# EAGLE design HD (EAGLE 9.5.2)
AUTHOR: Xueshi; COMPANY: DTU; DATE: 2017-12-20; INFOSETTINGS: Used by 'plot.ulp' - do not edit manually! |FileTime=2017-04-26, 16:03:01|FileVersion=2||[LabelBox]|Company=DTU|Title=BroadbandHD|Description=|Revision=2015-01-21|Date=2015-01-21|Author=T. Gehring|RevisionDate1=|RevisionAuthor1=|RevisionDate2=|RevisionAuthor2=|RevisionDate3=|RevisionAuthor3=|RevisionDate4=|RevisionAuthor4=|RevisionDate5=|RevisionAuthor5=||[FrontMatter]|DocTitle=Homodyne Detector @1550nm for Tomography|SubTitle=Circuit Board Documentation|Authors=Xueshi Guo|Keywords=|Abstract=Broadband homodyne detector with DC and highpass filtered AC output.\nModified based on the design of G. Tobias.|LaTeXSyntax=0||[Safety]|VoltageHazard=0|HeatHazard=0|Convection=0|ForcedAir=0|WaterCooling=0|LightHazard=0|LaserPower=1000|LaserWavelength=1064|LaserClass=6|LightPower=1000|LightInvisible=0||[Notes]|Machinery=0|IntendedUsers=0|DisplayHints=1|; PLOTSETTINGS: Used by 'plot.ulp' - do not edit manually! |FileTime=2017-04-26, 16:03:01|FileVersion=2||[Board]|CreateBoard=1|PadDisplay=1|CreateDrillPlan=1|SiebMeyerFormat=0|IsiDrillFormat=1|CreateSolderStop=1|CreateCreamMask=0|CreateLegend=0|DisplayDimension=0|DisplayReference=1|CompensateSkew=0||[Documentation]|CreateDocumentation=1|CreateSheetDocs=1|DisplayNames=1|DisplayValues=1|DisplaySimulate=0|CreatePartList=1|CreateBoardDocs=1|CreatePlaceplan=1|DisplayJumper=0|CreateWiring=1|DisplayVias=1|CreateDrillMap=0|Create800uMap=0|CreatePreview=0|CreateValueList=1|CreateNetList=0|CreateLaTeX=1||[Variants]|HighlightUndefines=1|HighlightVariants=1|ShowVariantLists=1||[BoardSetup]|ProcessPolygons=0|PageSize=0|PageOrientation=0|MarginLeft=5|MarginTop=5|MarginRight=5|MarginBottom=5|DrillRackMM=0||[DocumentationSetup]|BlackWhite=0|FigureWidth=168|FigureHeight=237|ShrinkFigure=1|ExpandFigure=0|FigureRotate=1|TextWidth=72|ValueLibrary=1|PalatinoFont=1|LuximonoFont=0|IgnoreWidth=1||[MiscSetup]|OutlinePrecision=0.5|OutlineDiameter=2|; REVISION: 2017-12-20; TITLE: HD@1550nm

## Sheet 1 of 3
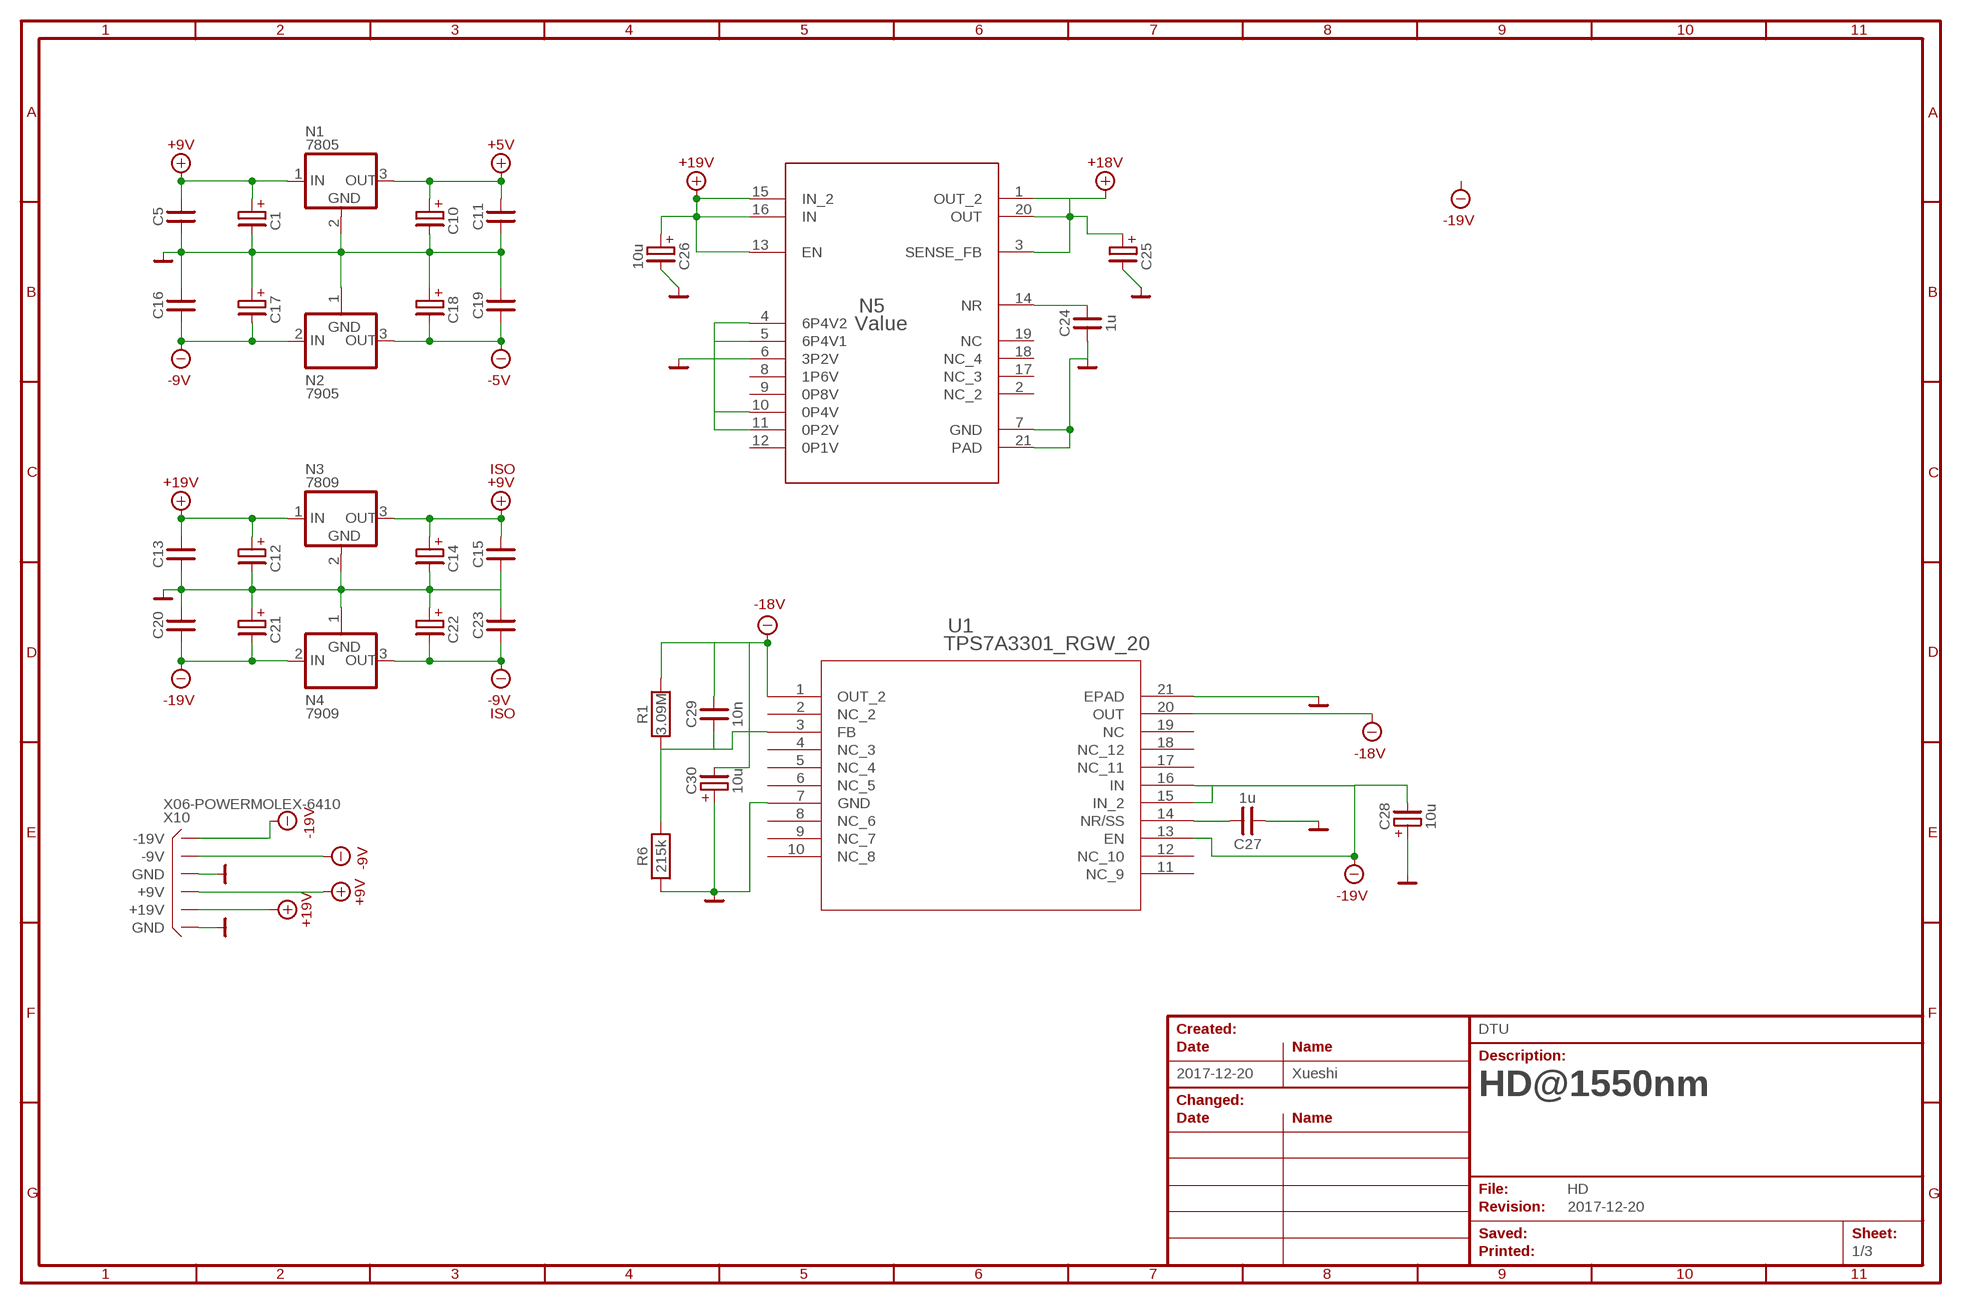
[diagram p0: schematic, sheet 1]
$1 (FRAME-A4-LANDSCAPE): SPICE: <ignore>

### Parts
C1  CEC  [CEC]
C5  C0805  [C0805]
C10  CEC  [CEC]
C11  C0805  [C0805]
C12  CEC  [CEC]
C13  C0805  [C0805]
C14  CEC  [CEC]
C15  C0805  [C0805]
C16  C0805  [C0805]
C17  CEC  [CEC]
C18  CEC  [CEC]
C19  C0805  [C0805]
C20  C0805  [C0805]
C21  CEC  [CEC]
C22  CEC  [CEC]
C23  C0805  [C0805]
C24  1u  C0805  [C0805]
C25  CEC  [CEC]
C26  10u  CEC  [CEC]
C27  1u  C0805  [C0805]
C28  10u  CEC  [CEC]
C29  10n  C0805  [C0805]
C30  10u  CEC  [CEC]
N1  7805  7805S2  [TO252]
N2  7905  7905S2  [TO252]
N3  7809  7809S2  [TO252]
N4  7909  7909S2  [TO252]
N5  Value  TPS7A4701RGWR  [RGW0020A]
R1  3.09M  R0805  [R0805]
R6  215k  R0805  [R0805]
U1  TPS7A3301_RGW_20  [RGW0020A]
X10  X06-POWERMOLEX-6410  [X06-MOLEX-6410]

### Nets
+5V: C10.+ C11.2 N1.3(OUT) ; supply symbol labelled V+5V ; also sheet 2
+9V: C1.+ C5.1 N1.1(IN) X10.P$4(+9V) ; supply symbol labelled V+9V
+9VISO: C14.+ C15.2 N3.3(OUT) ; supply symbol labelled V+9V-ISO ; also sheet 3
+18V: C25.+ N5.1(OUT_2) N5.3(SENSE_FB) N5.20(OUT) ; supply symbol labelled V+18V ; also sheet 2
+19V: C12.+ C13.1 C26.+ N3.1(IN) N5.13(EN) N5.15(IN_2) N5.16(IN) X10.P$5(+19V) ; supply symbol labelled V+19V
-5V: C18.- C19.1 N2.3(OUT) ; supply symbol labelled V-5V ; also sheet 2
-9V: C16.2 C17.- N2.2(IN) X10.P$2(-9V) ; supply symbol labelled V-9V
-9VISO: C22.- C23.1 N4.3(OUT) ; supply symbol labelled V-9V-ISO ; also sheet 3
-18V: C29.2 C30.- R1.2 U1.1(OUT_2) U1.20(OUT) ; supply symbol labelled V-18V ; also sheet 2
-19V: C20.2 C21.- C28.- N4.2(IN) U1.13(EN) U1.15(IN_2) U1.16(IN) X10.P$1(-19V) ; supply symbol labelled V-19V
GND: C1.- C5.2 C10.- C11.1 C12.- C13.2 C14.- C15.1 C16.1 C17.+ C18.+ C19.2 C20.1 C21.+ C22.+ C23.2 C24.1 C25.- C26.- C27.1 C28.+ C30.+ N1.2(GND) N2.1(GND) N3.2(GND) N4.1(GND) N5.4(6P4V2) N5.5(6P4V1) N5.6(3P2V) N5.7(GND) N5.10(0P4V) N5.11(0P2V) N5.21(PAD) R6.1 U1.7(GND) U1.21(EPAD) X10.P$3(GND) X10.P$6(GND) ; supply symbol labelled VG ; also sheet 2,3
N$2: C24.2 N5.14(NR)
N$5: C27.2 U1.14(NR/SS)
N$9: C29.1 R1.1 R6.2 U1.3(FB)
Unconnected: N5.2(NC_2) N5.8(1P6V) N5.9(0P8V) N5.12(0P1V) N5.17(NC_3) N5.18(NC_4) N5.19(NC) U1.2(NC_2) U1.4(NC_3) U1.5(NC_4) U1.6(NC_5) U1.8(NC_6) U1.9(NC_7) U1.10(NC_8) U1.11(NC_9) U1.12(NC_10) U1.17(NC_11) U1.18(NC_12) U1.19(NC)

## Sheet 2 of 3
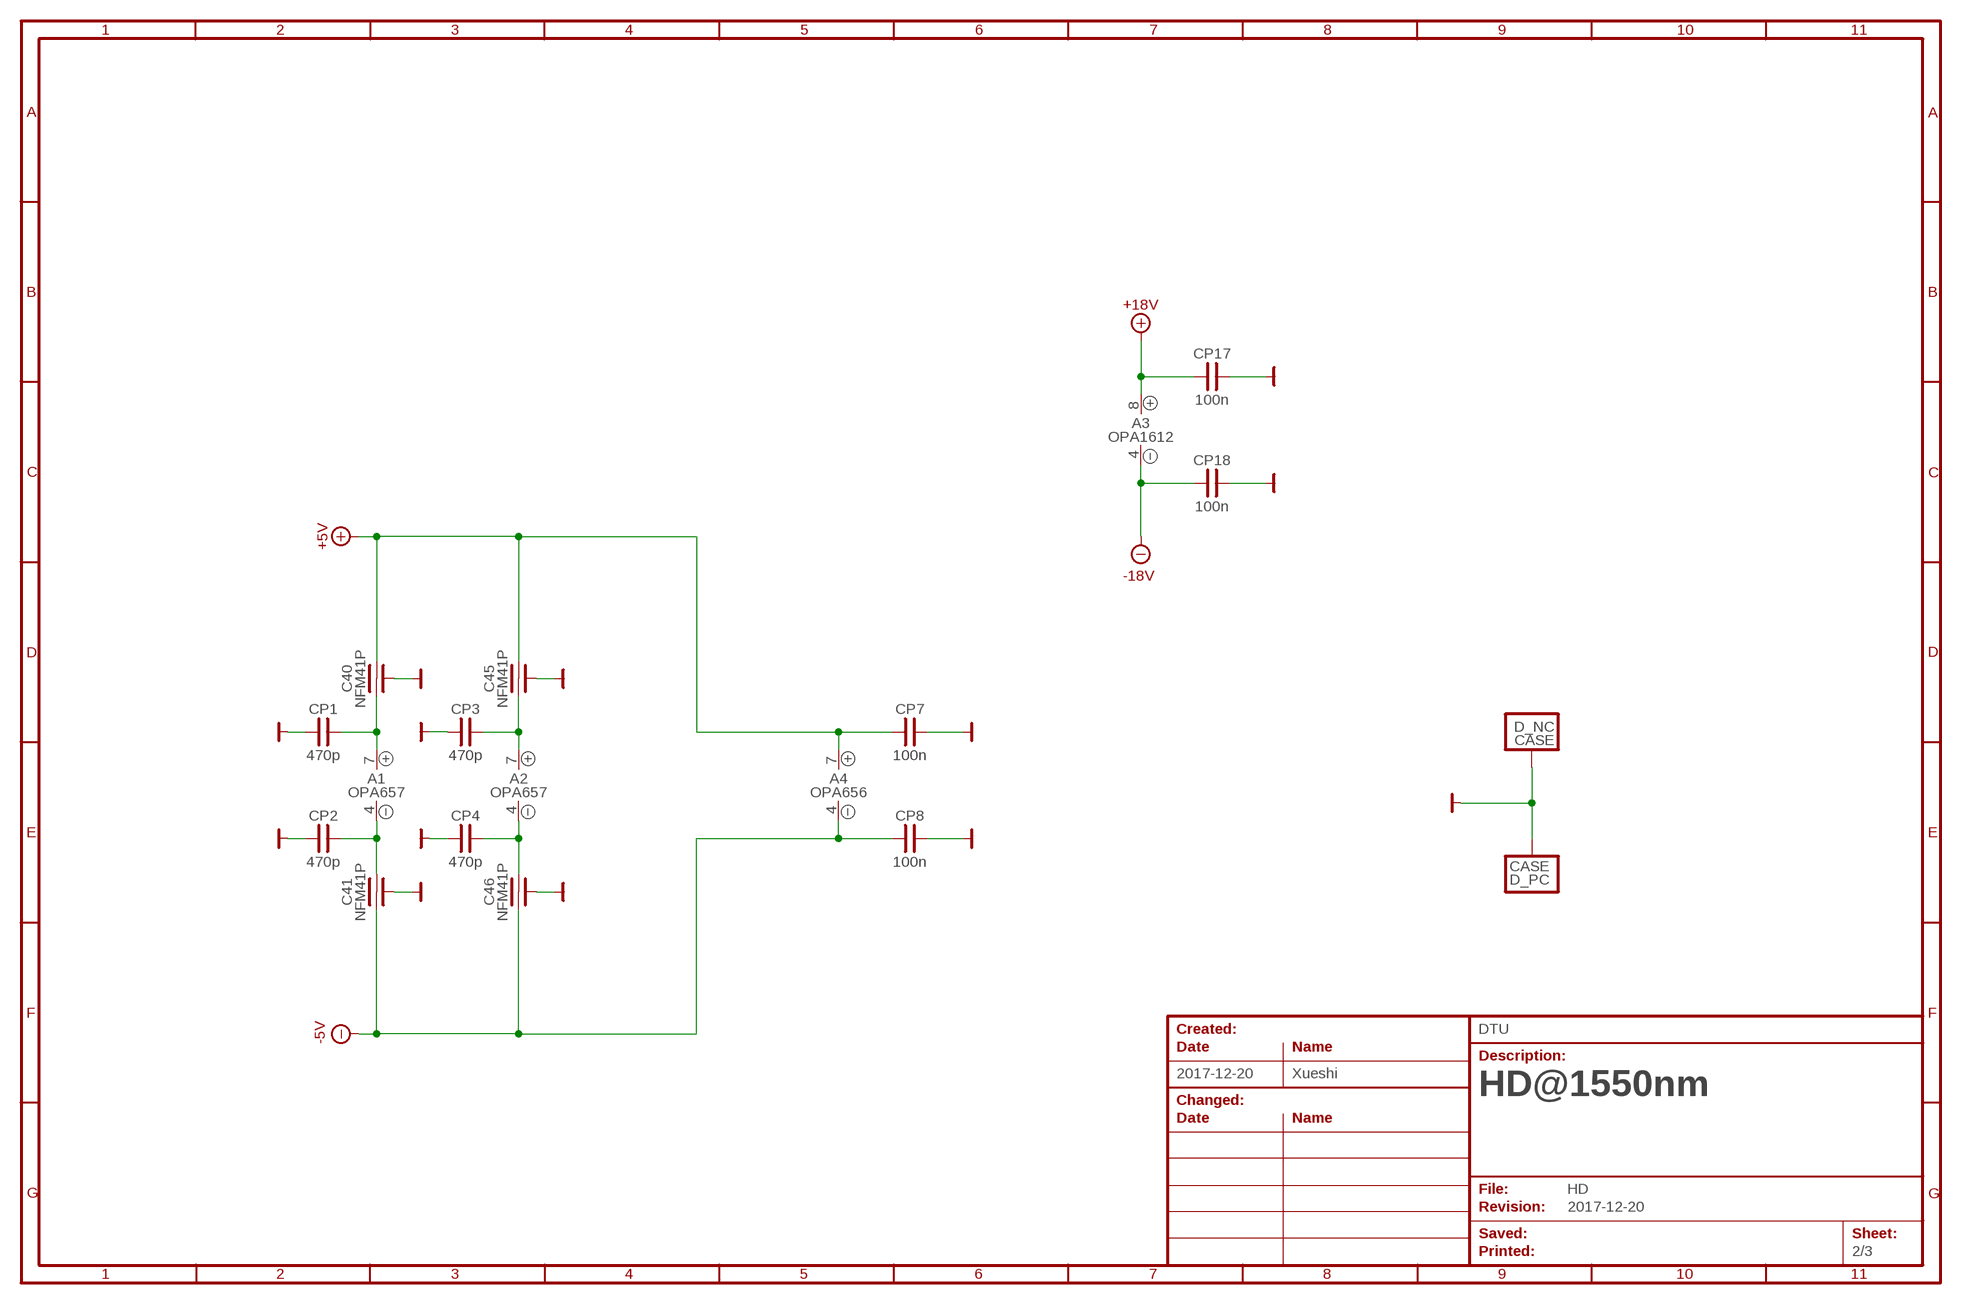
[diagram p1: schematic, sheet 2]
$8 (FRAME-A4-LANDSCAPE): SPICE: <ignore>

### Parts
A1  OPA657  [SO08]
A2  OPA657  [SO08]
A3  OPA1612  OPA2107S  [SO08]
A4  OPA656  OPA657  [SO08]
C40  NFM41P  CF  [CF-NFM41P]
C41  NFM41P  CF  [CF-NFM41P]
C45  NFM41P  CF  [CF-NFM41P]
C46  NFM41P  CF  [CF-NFM41P]
CP1  470p  C0603  [C0603]
CP2  470p  C0603  [C0603]
CP3  470p  C0603  [C0603]
CP4  470p  C0603  [C0603]
CP7  100n  C0603  [C0603]
CP8  100n  C0603  [C0603]
CP17  100n  C0603  [C0603]
CP18  100n  C0603  [C0603]
D_N  0.2pF  DP-CLASER_COMPONENTS_PD  [STO5P]
D_P  0.2pF  DP-CLASER_COMPONENTS_PD  [STO5P]

### Nets
+5V: A4.7(P:V+) C40.2 C45.2 CP7.1 ; supply symbol labelled V+5V ; also sheet 1
+18V: A3.8(P:V+) CP17.1 ; supply symbol labelled V+18V ; also sheet 1
-5V: A4.4(P:V-) C41.1 C46.1 CP8.1 ; supply symbol labelled V-5V ; also sheet 1
-18V: A3.4(P:V-) CP18.1 ; supply symbol labelled V-18V ; also sheet 1
GND: C40.GND C41.GND C45.GND C46.GND CP1.1 CP2.1 CP3.1 CP4.1 CP7.2 CP8.2 CP17.2 CP18.2 D_N.3(CASE) D_P.3(CASE) ; supply symbol labelled VG ; also sheet 1,3
N$41: A1.4(P:V-) C41.2 CP2.2
N$43: A1.7(P:V+) C40.1 CP1.2
N$45: A2.4(P:V-) C46.2 CP4.2
N$46: A2.7(P:V+) C45.1 CP3.2

## Sheet 3 of 3
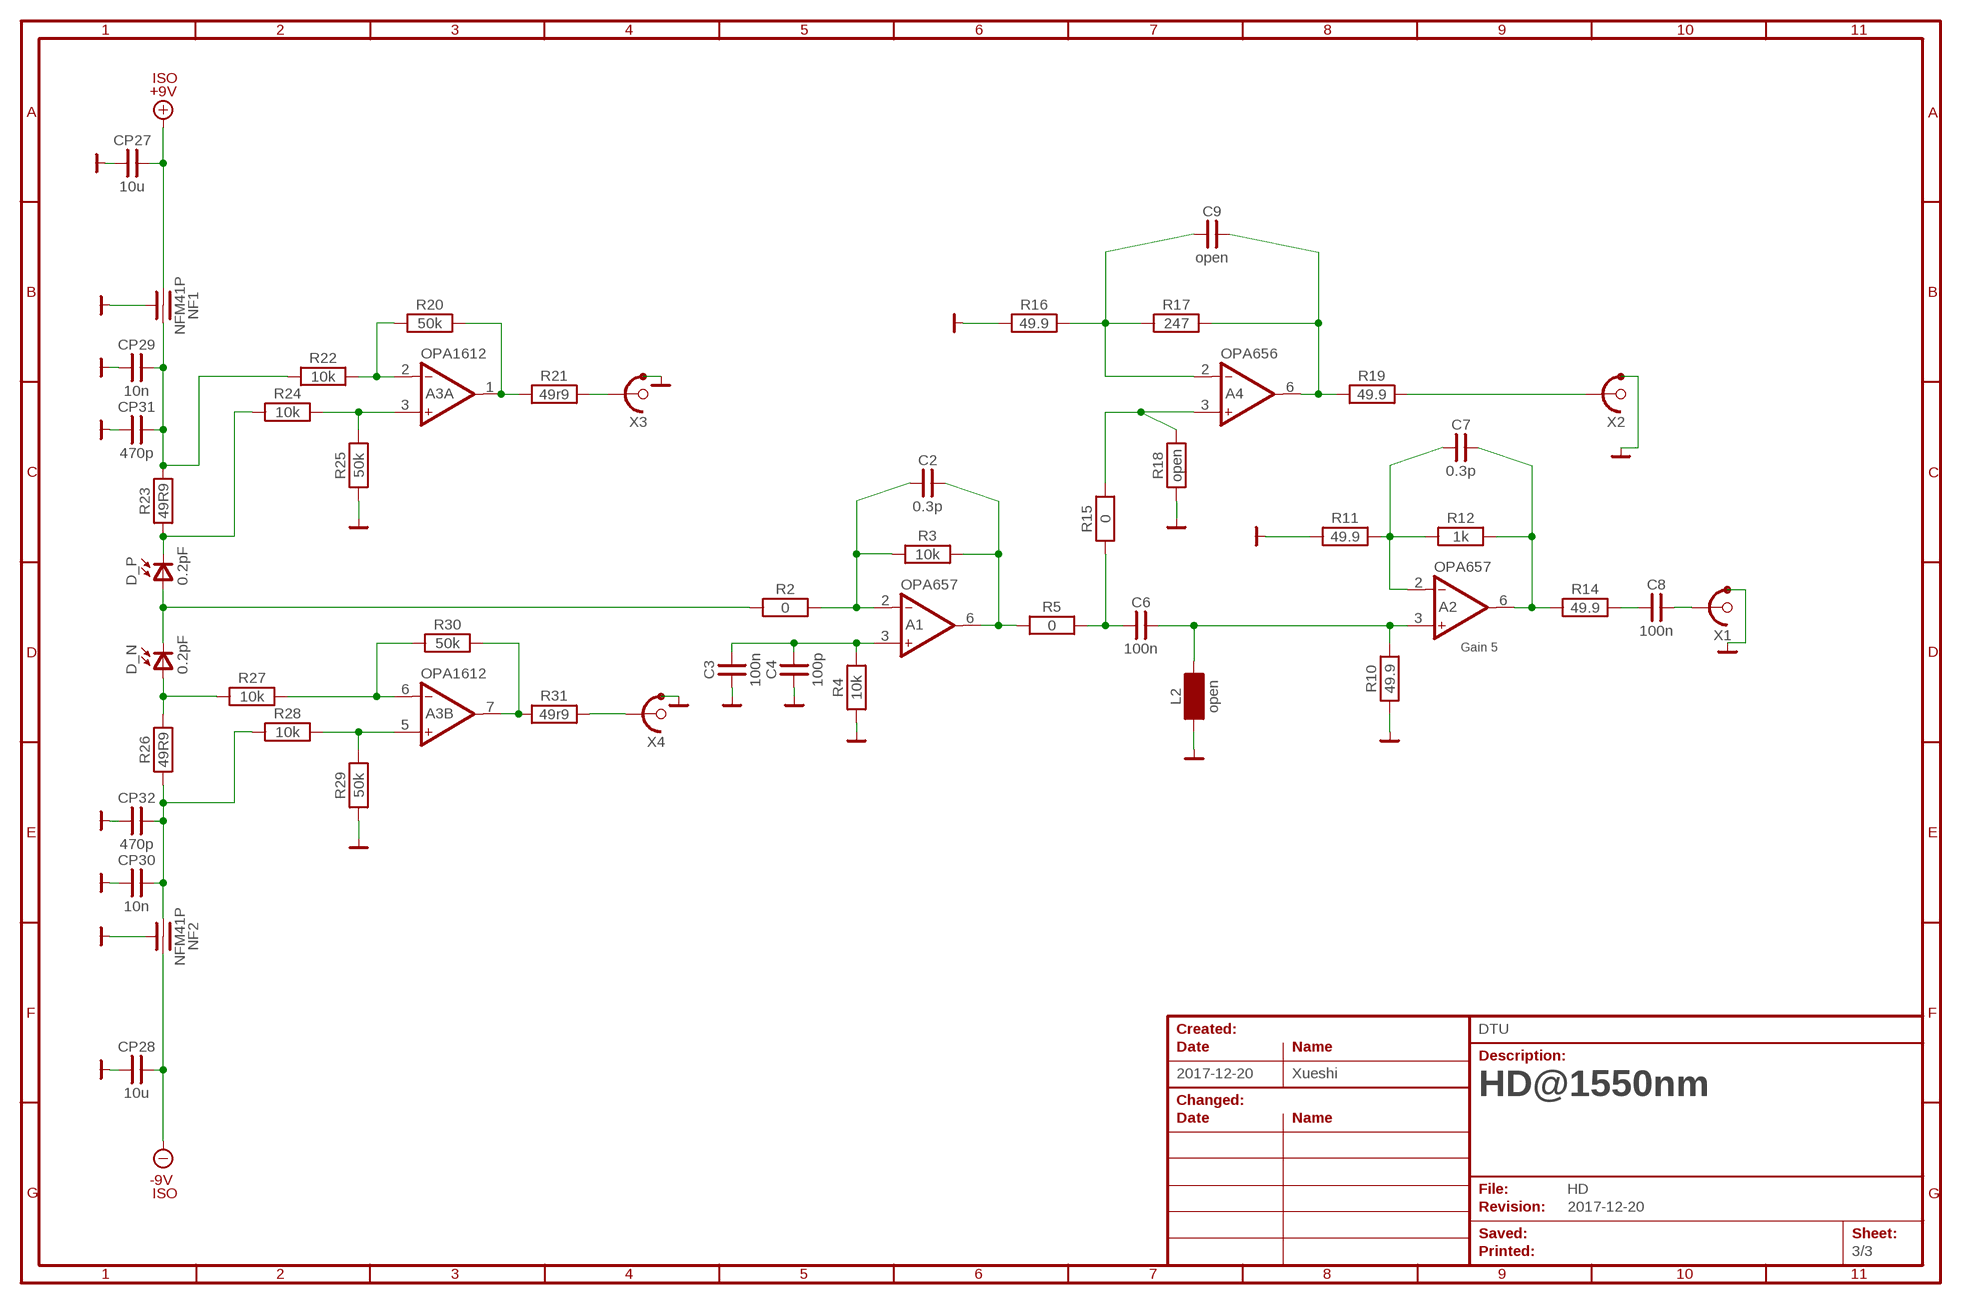
[diagram p2: schematic, sheet 3]
$68 (FRAME-A4-LANDSCAPE): SPICE: <ignore>

### Parts
C2  0.3p  C0603  [C0603]
C3  100n  C0603  [C0603]
C4  100p  C0603  [C0603]
C6  100n  C0603  [C0603]
C7  0.3p  C0603  [C0603]
C8  100n  C0603  [C0603]
C9  open  C0603  [C0603]
CP27  10u  C1206  [C1206]
CP28  10u  C1206  [C1206]
CP29  10n  C0805  [C0805]
CP30  10n  C0805  [C0805]
CP31  470p  C0805  [C0805]
CP32  470p  C0805  [C0805]
L2  open  L0603  [L0603]
NF1  NFM41P  CF  [CF-NFM41P]
NF2  NFM41P  CF  [CF-NFM41P]
R2  0  R0603  [R0603]
R3  10k  R0603  [R0603]
R4  10k  R0603  [R0603]
R5  0  R0603  [R0603]
R10  49.9  R0603  [R0603]
R11  49.9  R0603  [R0603]
R12  1k  R0603  [R0603]
R14  49.9  R0603  [R0603]
R15  0  R0805  [R0805]
R16  49.9  R0603  [R0603]
R17  247  R0603  [R0603]
R18  open  R0603  [R0603]
R19  49.9  R0603  [R0603]
R20  50k  R0603  [R0603]
R21  49r9  R0603  [R0603]
R22  10k  R0603  [R0603]
R23  49R9  R0603  [R0603]
R24  10k  R0603  [R0603]
R25  50k  R0603  [R0603]
R26  49R9  R0603  [R0603]
R27  10k  R0603  [R0603]
R28  10k  R0603  [R0603]
R29  50k  R0603  [R0603]
R30  50k  R0603  [R0603]
R31  49r9  R0603  [R0603]
X1  XS01-PCB  [XS01-UFL]
X2  XS01-PCB  [XS01-UFL]
X3  XS01-PCB  [XS01-UFL]
X4  XS01-PCB  [XS01-UFL]

### Nets
+9VISO: CP27.2 NF1.1 ; supply symbol labelled V+9V-ISO ; also sheet 1
-9VISO: CP28.2 NF2.2 ; supply symbol labelled V-9V-ISO ; also sheet 1
GND: C3.1 C4.1 CP27.1 CP28.1 CP29.1 CP30.1 CP31.1 CP32.1 L2.1 NF1.GND NF2.GND R4.1 R10.1 R11.1 R16.1 R18.1 R25.1 R29.1 X1.GND1(GND) X1.GND2(GND) X2.GND1(GND) X2.GND2(GND) X3.GND1(GND) X3.GND2(GND) X4.GND1(GND) X4.GND2(GND) ; supply symbol labelled VG ; also sheet 1,2
N$1: CP29.2 CP31.2 NF1.2 R22.1 R23.2
N$4: A2.2(A:IN-) C7.1 R11.2 R12.1
N$7: A1.2(A:IN-) C2.1 R2.2 R3.1
N$8: A4.6(A:OUT) C9.2 R17.2 R19.1
N$11: C6.1 R5.2 R15.1
N$12: A2.6(A:OUT) C7.2 R12.2 R14.1
N$13: A4.3(A:IN+) R15.2 R18.2
N$14: C8.1 R14.2
N$15: A1.3(A:IN+) C3.2 C4.2 R4.2
N$17: C8.2 X1.SIG
N$19: D_N.2(C) D_P.1(A) R2.1
N$20: A4.2(A:IN-) C9.1 R16.2 R17.1
N$22: R19.2 X2.SIG
N$23: A3.2(A:IN-) R20.1 R22.2
N$24: A3.1(A:OUT) R20.2 R21.1
N$26: R21.2 X3.SIG
N$27: D_P.2(C) R23.1 R24.1
N$28: D_N.1(A) R26.2 R27.1
N$29: R31.2 X4.SIG
N$30: A3.3(A:IN+) R24.2 R25.2
N$34: CP30.2 CP32.2 NF2.1 R26.1 R28.1
N$35: A3.6(B:IN-) R27.2 R30.1
N$37: A3.5(B:IN+) R28.2 R29.2
N$38: A3.7(B:OUT) R30.2 R31.1
N$50: A1.6(A:OUT) C2.2 R3.2 R5.1
RF: A2.3(A:IN+) C6.2 L2.2 R10.2

### Notes on the sheet
- Gain 5

## Library data of the parts
A1 A2 = opamps:OPA657: OPA657: High speed FET opamp (Burr-Brown) ±5V, ±50mA, 5pA bias 600µV offset, 1.6GHz UGF, 4.8nV/rt(Hz) noise _____ References: - PDF datasheet <http://elektronik.aei.uni-hannover.de:3000/datasheets/opamps/opamps/opa657.pdf> (electronics workshop server) - Manufacturer's link <http://www.ti.com/product/opa657> (Texas Instruments website) - Internet search <http://www.google.de/search?q=opa657 amplifier> (Google results) _____ Supported SPICE subcircuits: OPA657 Supported LISO model: OPA657; LISO: <gate:A>\n op <part> <value> <pin:A.IN+> <pin:A.IN-> <pin:A.OUT>\n <warning:Power supply of <part> not included in simulation>\n\n<gate:P>\n <ignore>; SPICE: <gate:A>\n <part:X> <pin:A.IN+> <pin:A.IN-> <pin:A.OUT> <pin:P.V+> <pin:P.V-> <subckt:OPA657>\n\n<gate:P>\n <ignore>
A3 = opamps:OPA2107: OPA2107: Dual DIFET opamp (Burr-Brown) ±15V, ±10mA, 35nA bias 2.5mV offset, 4.5MHz UGF, 30nV/rt(Hz) noise _____ References: - PDF datasheet <http://elektronik.aei.uni-hannover.de:3000/datasheets/opamps/opamps/opa2107.pdf> (electronics workshop server) - Manufacturer's link <http://www.ti.com/product/opa2107> (Texas Instruments website) - Internet search <http://www.google.de/search?q=opa2107 amplifier> (Google results) _____ Supported SPICE subcircuits: OPA2107, OPA2107E; SPICE: <gate:A>\n <name:X> <pin:A.IN+> <pin:A.IN-> <pin:P.V+> <pin:P.V-> <pin:A.OUT> <subckt:OPA2107 OPA2107E>\n\n<gate:B>\n <name:X> <pin:B.IN+> <pin:B.IN-> <pin:P.V+> <pin:P.V-> <pin:B.OUT> <subckt:OPA2107 OPA2107E>\n\n<gate:P>\n <ignore>; VALUE: OPA2107
A4 = opamps:OPA657: OPA657: High speed FET opamp (Burr-Brown) ±5V, ±50mA, 5pA bias 600µV offset, 1.6GHz UGF, 4.8nV/rt(Hz) noise _____ References: - PDF datasheet <http://elektronik.aei.uni-hannover.de:3000/datasheets/opamps/opamps/opa657.pdf> (electronics workshop server) - Manufacturer's link <http://www.ti.com/product/opa657> (Texas Instruments website) - Internet search <http://www.google.de/search?q=opa657 amplifier> (Google results) _____ Supported SPICE subcircuits: OPA657 Supported LISO model: OPA657; LISO: <gate:A>\n op <part> <value> <pin:A.IN+> <pin:A.IN-> <pin:A.OUT>\n <warning:Power supply of <part> not included in simulation>\n\n<gate:P>\n <ignore>; SPICE: <gate:A>\n <part:X> <pin:A.IN+> <pin:A.IN-> <pin:A.OUT> <pin:P.V+> <pin:P.V-> <subckt:OPA657>\n\n<gate:P>\n <ignore>; VALUE: OPA657
C1 C10 C12 C14 C17 C18 C21 C22 C25 C26 C28 C30 = miscs:CE: Electrolytic capacitor, unipolar _____ SPICE implementation as a bipolar capacitor with the supported attributes: VALUE, VOLTAGE, CPARALLEL, LSERIES, RLSHUNT, RPARALLEL, RSERIES (A detailed description of these parameters can be found in the library spice.lbr); SPICE: <IDEALMODEL>\n<name:C> <pin:A.+> <pin:A.-> <autovalue><voltage: ic=>\n\n<REALMODEL>\n<name:C> <pin:A.+> <pin:A.-> <autovalue><voltage: ic=><rseries: rser=><lseries: lser=><rparallel: rpar=><cparallel: cpar=><rlshunt: rlshunt=>
C2-C9 C11 C13 C15 C16 C19 C20 C23 C24 C27 C29 CP1-CP4 CP7 CP8 CP17 CP18 CP27-CP32 = miscs:C: Capacitor, bipolar _____ Supported SPICE attributes: VALUE, VOLTAGE, CPARALLEL, LSERIES, RLSHUNT, RPARALLEL, RSERIES (A detailed description of these parameters can be found in the library spice.lbr) _____ References (PDF files, electronics workshop server): WIMA FKP 02 <http://elektronik.aei.uni-hannover.de:3000/datasheets/capacitors/wima-fkp02.pdf> (polypropylene film capacitors, 0.1" spacing) WIMA FKP 2 <http://elektronik.aei.uni-hannover.de:3000/datasheets/capacitors/wima-fkp2.pdf> (polypropylene film capacitors, 0.2" spacing) WIMA FKS 2 <http://elektronik.aei.uni-hannover.de:3000/datasheets/capacitors/wima-fks2.pdf> (polyester film capacitors, 0.2" spacing) WIMA MKP 2 <http://elektronik.aei.uni-hannover.de:3000/datasheets/capacitors/wima-mkp2.pdf> (polypropylene film capacitors, 0.2" spacing) WIMA MKS 02 <http://elektronik.aei.uni-hannover.de:3000/datasheets/capacitors/wima-mks02.pdf> (polyester film capacitors, 0.1" spacing) WIMA MKS 2 <http://elektronik.aei.uni-hannover.de:3000/datasheets/capacitors/wima-mks2.pdf> (polyester film capacitors, 0.2" spacing) Kemet ceramics <http://elektronik.aei.uni-hannover.de:3000/datasheets/capacitors/kemet-ceramics.pdf> (multilayer ceramic leaded capacitors) Vishay ceramics HV <http://elektronik.aei.uni-hannover.de:3000/datasheets/capacitors/vishay-ceramic-hv.pdf> (multilayer ceramic leaded capacitors, high voltage) LCR polystyrene <http://elektronik.aei.uni-hannover.de:3000/datasheets/capacitors/lcr-polystyrene.pdf> (polystyrene radial capacitors, 0.2" spacing); SPICE: <IDEALMODEL>\n<name:C> <pin:A.1> <pin:A.2> <autovalue><voltage: ic=>\n\n<REALMODEL>\n<name:C> <pin:A.1> <pin:A.2> <autovalue><voltage: ic=><rseries: rser=><lseries: lser=><rparallel: rpar=><cparallel: cpar=><rlshunt: rlshunt=>
C40 C41 C45 C46 NF1 NF2 = miscs:CF: Feedthrough capacitor bipolar _____ SPICE implementation as a bipolar capacitor in the center of two 50µΩ resistors, supporting the attributes: VALUE, VOLTAGE (A detailed description of these parameters can be found in the library spice.lbr); SPICE: <name:R>.left <pin:A.1> <name>.C 50u\n<name:R>.right <name>.C <pin:A.2> 50u\n<name:C> <name>.C <pin:A.GND> <autovalue><voltage: ic=>
D_N D_P = optos:DP-C: Photodiode with case pin
L2 = miscs:L: Coil, European symbol _____ Supported SPICE attributes: VALUE, CURRENT, CPARALLEL, RPARALLEL, RSERIES (A detailed description of these parameters can be found in the library spice.lbr); SPICE: <IDEALMODEL>\n<name:L> <pin:A.1> <pin:A.2> <autovalue><current: ic=>\n\n<REALMODEL>\n<name:L> <pin:A.1> <pin:A.2> <autovalue><current: ic=><rseries: rser=><rparallel: rpar=><cparallel: cpar=>
N1 = ics:78*: 78xx: Fixed positive voltage regulator Voltage can be selected with change technology; TYPE: 7805
N2 = ics:79*: 79xx: Fixed negative voltage regulator Voltage can be selected with change technology; TYPE: 7905
N3 = ics:78*: 78xx: Fixed positive voltage regulator Voltage can be selected with change technology; TYPE: 7809
N4 = ics:79*: 79xx: Fixed negative voltage regulator Voltage can be selected with change technology; TYPE: 7909
N5 = regulators:TPS7A4701RGWR; MANUFACTURER: Texas Instruments; PARTNUMBER: TPS7A4701RGWR; REFDES: RefDes; TYPE: TYPE
R1-R6 R10-R12 R14-R31 = miscs:R: Resistor, European symbol _____ Supported SPICE attributes: VALUE (A detailed description of these parameters can be found in the library spice.lbr); SPICE: <name:R> <pin:A.1> <pin:A.2> <autovalue>
U1 = regulators:TPS7A3301_RGW_20; DATASHEETURL: httpwww.ti.comlitgpnTPS7A3301; FAMILY_NAME: SINGLE CHANNEL LDO; GENERIC_PART_NUMBER: TPS7A3301; INDUSTRY_STD_PKG_TYPE: VQFN; MANUFACTURER: Texas Instruments; MANUFACTURER_PART_NUMBER: tps7a3301_rgw_20; PACKAGE_DESIGNATOR: RGW; PIN_COUNT: 20; VENDOR: Texas Instruments
X1-X4 = connectors:XS01: Shielded connector, 1 shield pin
X10 = connectors:X06-POWER: 6 pins PCB power connector

## Board
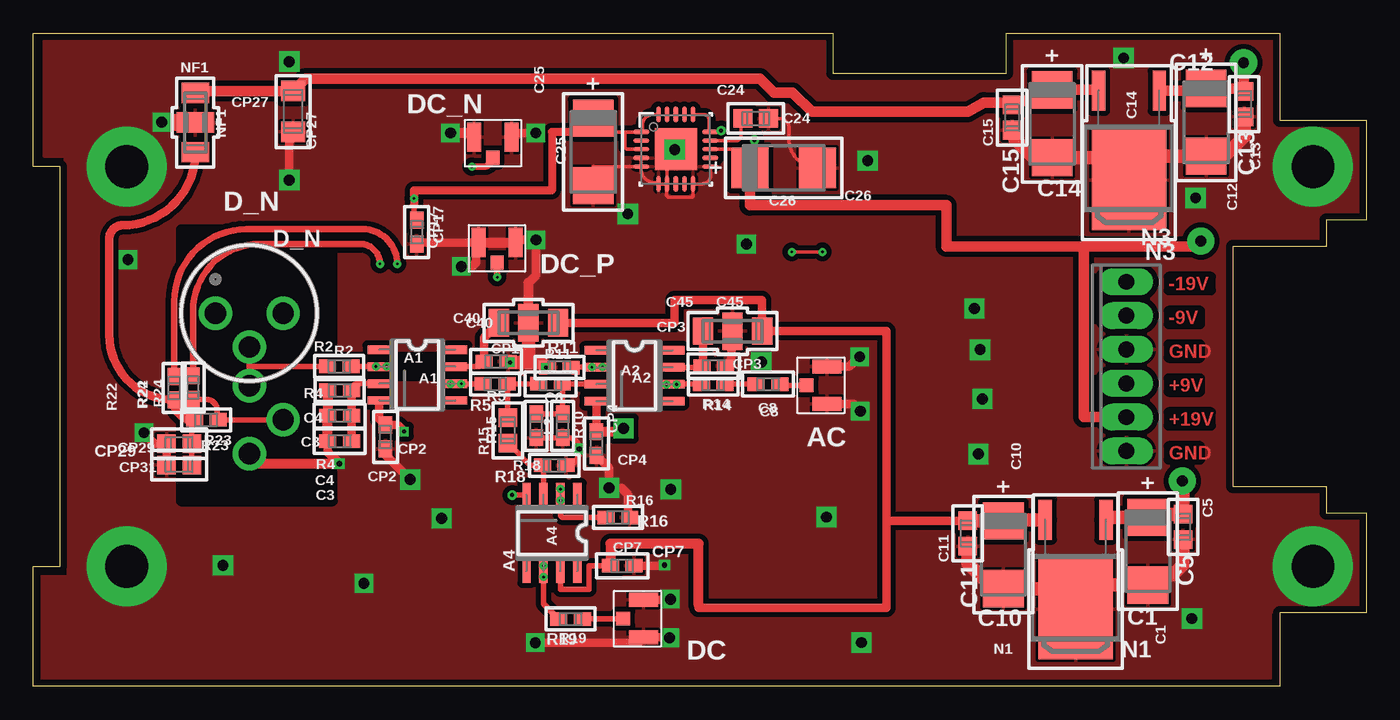
[diagram p3: board, top side]
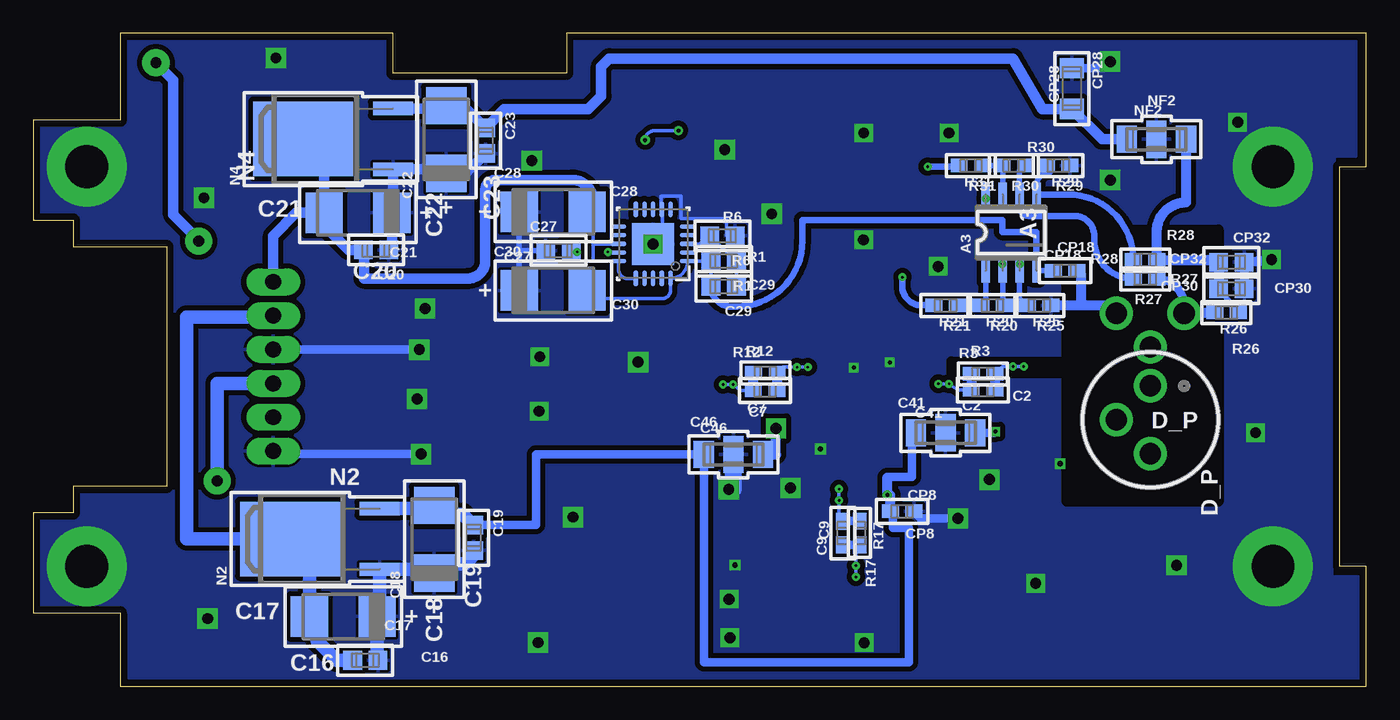
[diagram p4: board, bottom side, seen from below]

Size 100 x 49 mm. Coordinates in mm from the lower left corner, seen from the top.
Outline: 93.5,49 93.5,42.5 100,42.5 100,35 97,35 97,33 90,33 90,15 97,15 97,13 100,13 100,5.5 93.5,5.5 93.5,0 0,0 0,9 2,9 2,39 0,39 0,49 60,49 60,46 73,46 73,49 93.5,49
Copper layers (1*16): Top 0.035mm / dielectric 1.5mm / Bottom 0.035mm
Design rules "doublesided *": minimum track width 0.2mm, minimum drill 0.2mm, track to track 0.2mm, track to pad 0.2mm, pad to pad 0.2mm, via to via 0.2mm, smd to smd 0mil, copper to edge 0.5mm, drill to drill 0.4mm, minimum pad ring 0.2mm, minimum via ring 0.2mm, stop-mask expansion 0.08mm, vias tented up to drill 0mil, thermal gap 0.2mm
tRestrict: area 11.1,13.9 to 22.5,34.3; area 22.3,23.3 to 31.2,24.7
bRestrict: area 11.1,13.8 to 22.5,34.3; area 20,23.5 to 31.1,24.4

### Footprints (pad centres in the part's own frame; a part is rotated, then mirrored left to right if it is on the bottom)
SO08 = smd 0.635 x 1.778: 1 -1.905,-2.857; 2 -0.635,-2.857; 3 0.635,-2.857; 4 1.905,-2.857; 5 1.905,2.857; 6 0.635,2.857; 7 -0.635,2.857; 8 -1.905,2.857
CEC = smd 2.794 x 3.048: + -2.54,0; - 2.54,0
C0603 = smd 1.27 x 1.016: 1 -0.889,0; 2 0.889,0
C0805 = smd 1.397 x 1.397: 1 -0.953,0; 2 0.953,0
CF-NFM41P = smd 1.524 x 2.032: 1 -2.223,0; 2 2.223,0 | smd 1.524 x 2.794: GND 0,0
C1206 = smd 1.524 x 1.778: 1 -1.529,0; 2 1.529,0
STO5P = drill 1.6 pad 2.5: 1 2.54,0; 2 0,2.54; 3 -2.54,0
L0603 = smd 1.27 x 1.016: 1 -0.889,0; 2 0.889,0
TO252 = smd 1 x 3: 1 -2.28,0.083; 3 2.28,0.083 | smd 5.6 x 7.5: 2 0,6.8
RGW0020A = smd 1.2 x 0.35: 1 -2.6,1.3; 2 -2.6,0.65; 3 -2.6,0; 4 -2.6,-0.65; 5 -2.6,-1.3; 11 2.6,-1.3; 12 2.6,-0.65; 13 2.6,0; 14 2.6,0.65; 15 2.6,1.3 | smd 0.35 x 1.2: 6 -1.3,-2.6; 7 -0.65,-2.6; 8 0,-2.6; 9 0.65,-2.6; 10 1.3,-2.6; 16 1.3,2.6; 17 0.65,2.6; 18 0,2.6; 19 -0.65,2.6; 20 -1.3,2.6 | smd 3.15 x 3.15: 21 0,0
R0805 = smd 1.397 x 1.397: 1 -0.953,0; 2 0.953,0
R0603 = smd 1.27 x 1.016: 1 -0.889,0; 2 0.889,0
XS01-UFL = smd 1.05 x 2.2: GND1 -1.4,0; GND2 1.4,0 | smd 1 x 1.05: SIG 0,-1.525
X06-MOLEX-6410 = drill 1.194 pad 2.032 long: P$1 6.35,0; P$2 3.81,0; P$3 1.27,0; P$4 -1.27,0; P$5 -3.81,0; P$6 -6.35,0

### Placement (x,y rotation side)
A1  28.81,23.35 270 top
A2  45.1,23.3 270 top
A3  26.64,34.05 0 bottom
A4  38.91,11.5 180 top
C1  83.62,10.13 270 top
C2  28.75,22.24 180 bottom
C3  22.98,18.39 0 top
C4  22.98,20.3 0 top
C5  86.26,11.96 270 top
C6  38.8,22.69 0 top
C7  45.1,22.2 180 bottom
C8  55.12,22.67 0 top
C9  39.26,11.49 270 bottom
C10  72.78,9.86 270 top
C11  70.11,11.46 90 top
C12  87.99,42.32 270 top
C13  90.84,43.68 270 top
C14  76.44,42.21 270 top
C15  73.44,42.68 90 top
C16  75.09,1.94 180 bottom
C17  76.74,5.23 180 bottom
C18  69.92,11.03 90 bottom
C19  66.97,11.14 270 bottom
C20  74.29,32.74 180 bottom
C21  75.64,35.53 180 bottom
C22  69.02,41.03 90 bottom
C23  66.07,40.94 270 bottom
C24  54.2,42.6 180 top
C25  42,40.1 270 top
C26  56.3,38.9 0 top
C27  60.6,32.7 0 bottom
C28  61,35.6 0 bottom
C29  48.2,30 180 bottom
C30  61,29.7 0 bottom
C40  37.15,27.27 0 top
C41  31.56,19.02 0 bottom
C45  52.46,26.64 0 top
C46  47.48,17.39 0 bottom
CP1  34.72,24.36 180 top
CP2  26.42,18.7 90 top
CP3  51.05,24.02 180 top
CP4  42.24,18.21 90 top
CP7  44.18,9.04 0 top
CP8  34.82,13.13 0 bottom
CP17  28.77,34.08 270 top
CP18  22.59,31.18 0 bottom
CP27  19.49,43.14 90 top
CP28  22.09,44.85 270 bottom
CP29  10.94,18.2 0 top
CP30  10.11,29.83 180 bottom
CP31  10.94,16.59 0 top
CP32  10.11,31.82 180 bottom
D_N  16.2,28 180 top
D_P  16.2,20 90 bottom
L2  37.73,19.54 90 top
N1  78.2,12.57 180 top
N2  73.94,11.05 90 bottom
N3  82.2,44.77 180 top
N4  72.94,41.07 90 bottom
N5  48.2,40.3 0 top
NF1  12.16,42.3 270 top
NF2  15.74,41.04 180 bottom
R1  48.2,31.9 180 bottom
R2  22.95,24 0 top
R3  28.74,23.44 180 bottom
R4  22.98,22.2 0 top
R5  34.65,22.69 0 top
R6  48.3,33.8 180 bottom
R10  39.71,19.54 90 top
R11  39.47,23.91 0 top
R12  45.08,23.51 180 bottom
R14  51.01,22.67 0 top
R15  35.6,19.2 270 top
R16  43.86,12.66 180 top
R17  38.01,11.5 270 bottom
R18  39.09,16.58 180 top
R19  40.31,5.04 0 top
R20  28.03,28.58 180 bottom
R21  31.55,28.58 180 bottom
R22  10.58,22.37 90 top
R23  12.98,19.99 180 top
R24  11.98,22.41 90 top
R25  24.53,28.58 180 bottom
R26  10.48,28.05 180 bottom
R27  16.58,30.57 180 bottom
R28  16.58,31.99 180 bottom
R29  23.11,39.08 180 bottom
R30  26.43,39.08 180 bottom
R31  29.65,39.08 180 bottom
U1  53.5,33.2 180 bottom
X1  59.54,22.58 270 top
X2  45.78,5.07 270 top
X3  34.79,33.31 0 top
X4  34.48,41.21 0 top
X10  82,24 90 top

### Tracks (layer width: path | path; a pad name or v marks a point on that pad's centre or on a via)
+5V
  Top 0.406: CP7.1 41.71,9.04 41.71,7.27 39.55,7.27 A4.7 | C40.2 | C40.2
  Top 0.635: 64.01,12.41 64.01,5.89 49.91,5.89 49.91,6.1 | C11.2 64.01,12.41 | 64.01,12.41 64.01,26.64 C45.2 54.68,29 48.1,29 48.1,27.27 C40.2
  Top 0.762: CP7.1 43.29,10.7 49.91,10.7 49.91,6.1
  Top 1: N1.3 72.87,12.49 C10.+ 72.77,12.41 C11.2
+9V  (via drill 0.81 pad 2.03)
  Top 1: N1.1 80.66,12.67 C1.+ 83.86,12.91 C5.1 86.26,15.4 v86.2,15.4
  Bottom 1: X10.P$4 86.2,22.73 v86.2,15.4
+9VISO
  Top 0.8: N3.3 79.86,44.75 C14.+ 76.22,44.53 C15.2 73.41,43.8 71.3,43.8 70.1,43.1 58.4,43.1 56.97,44.53 55.57,44.53 54.5,45.6 20.42,45.6 CP27.2 12.3,44.66 NF1.1
  Top 1.27: 12.28,44.64 NF1.1
+18V  (via drill 0.2 pad 0.6)
  Top 0.254: 44.4,41.6 N5.1 arc90 45.7,41.7 45.7,42.1 arc-90 46.5,42.9 N5.20 | 44.4,41.6 42,41.6 C25.+ | N5.3 44.6,40.3 arc-90 44.4,40.5 44.4,41.6
  Top 0.406: CP17.1 arc-90 28.55,35.19 28.55,36.1 v28.55,36.61
  Top 0.6: 42,41.6 38.9,41.6 38.9,37.2 28.55,37.2 A3.8 28.55,36.1
  Bottom 0.406: A3.8 arc-90 A3.8 v28.55,36.61
+19V  (via drill 0.3 pad 0.5, 0.81 pad 2.03)
  Top 0.254: N5.16 50.3,42.9 arc-90 50.7,42.5 50.7,41.7 arc90 N5.15 51.5,41.6 arc90 v51.6,41.7 | N5.13 52.36,40.3 arc-90 C26.+ 53.76,39.16 arc-90 54.1,39.5 v54.1,41
  Top 0.8: X10.P$5 78.8,20.19 78.8,33 | N3.1 87.82,44.69 C12.+ 90.61,44.86 C13.1 90.8,44.67 v90.8,46.8 | 78.8,33 68.5,33 68.5,36.1 53.76,36.1 C26.+ | 78.8,33 87.2,33 v87.6,33.4
  Bottom 0.254: v51.6,41.7 53.4,41.7 arc-90 v54.1,41
  Bottom 0.8: v87.6,33.4 87.6,33.5 89.5,35.4 89.5,45.5 v90.8,46.8
-5V  (via drill 0.3 pad 0.6)
  Top 0.406: v35.93,14.35 v35.93,14.36 A4.4
  Bottom 0.635: C19.1 62.3,12.09 62.3,17.39 C46.1 49.7,1.8 34.3,1.8 34.3,11.9 35.5,11.9 35.5,13.13 CP8.1 | 35.93,15.64 35.93,15.7 34.1,15.7 34.1,19.02 C41.1
  Bottom 0.762: CP8.1 35.71,14.35 v35.93,14.35 35.93,15.64
  Bottom 1: N2.3 70.16,13.33 C18.- 69.25,12.9 67.8,12.9 66.99,12.09 C19.1
  Bottom 1.016: 34.01,18.8 C41.1 | C46.1 49.7,17.34
-9V
  Bottom 1: C16.2 77.24,1.94 78.7,3.4 78.7,4.65 C17.- 79.28,9.59 N2.2 88.5,11.05 88.5,27.7 82,27.7 X10.P$2
-9VISO
  Bottom 0.8: N4.3 69.24,43.35 C22.- 67.75,43.57 C23.1 64.66,43.3 58.4,43.3 57.4,44.3 57.4,46.5 56.8,47.1 26.5,47.1 24.3,43.32 CP28.2 19.81,41.04 NF2.2
-18V
  Bottom 0.254: C29.2 R1.2 U1.1 arc90 U1.20 52.2,29.7 arc90 52.8,29.1 58.1,29.1 arc90 58.46,29.46 C30.-
  Bottom 0.406: A3.4 23.49,31.19 arc90 CP18.1
  Bottom 0.5: A3.4 24.73,34.1 27.3,34.1 27.3,35 42.3,35 42.3,33.4 arc90 47.2,28.5 47.65,28.5 arc90 C29.2
-19V
  Bottom 0.254: C28.- 58,35.6 58,33.2 | 58,33.2 58,31.9 U1.15 56.1,31.3 arc-90 55.4,30.6 U1.16 | U1.13 58,33.2
  Bottom 0.8: C21.- 78.18,34.58 76.34,32.74 C20.2 arc90 75.2,32.7 75.2,30.6 67.4,30.6 arc-90 66.1,31.9 66.1,37.2 arc90 65.3,38 59.6,38 arc90 58,36.4 58,36.06 arc90 C28.- | X10.P$1 82,33.8 80.27,35.53 C21.- | N4.2 78.18,39.51 C21.-
GND  (via drill 0.3 pad 0.6, 0.4 pad 0.8, 0.81 pad 1.4, 0.81 pad 1.52, 3.2 pad 6)
  Top 0.254: N5.5 42,39 C25.- | N5.4 N5.5 | N5.5 45.6,38.8 arc90 46.6,37.8 46.8,37.8 arc-90 N5.6 N5.7 | N5.7 arc90 47.5,37.65 47.5,36.9 arc90 47.7,36.7 49.4,36.7 arc90 49.5,36.8 N5.10 50.2,37.7 arc90 50.8,38.3 N5.11 | N5.21 arc90 47.55,39.65 N5.7 | C26.- arc-90 56.7,41.04 56.7,41.9 arc90 56,42.6 C24.1
  Top 0.406: L2.1 R10.1 40.11,18.65 arc-90 v40.95,17.81 40.95,17.55 arc-90 R18.1 | CP1.1 35.75,24.36 v35.75,24.31 | R11.1 38.05,23.91 38.05,24.31
  Top 0.635: CP3.1 52.4,24.48 52.4,27.3 | C3.1 22.09,17.58 v22.97,16.71 | CP2.1 26.42,17.36 v28.27,15.51 | CP31.1 CP29.1 9.12,18.2 v8.3,19.02 | CP7.2 47.31,9.04 v47.35,9.08 | X2.GND1 47.74,6.47 v47.8,6.53 | v47.74,3.63 47.7,3.67 X2.GND2 45.38,3.27 v37.67,3.27 | X1.GND2 61.51,21.18 v62.05,20.64 | X1.GND1 61.25,23.98 v61.99,24.73 | X4.GND2 36.19,41.52 v37.7,41.52 | X3.GND2 36.38,33.5 v37.71,33.5 37.71,30.84 37.15,30.27 | CP17.2 28.89,33.31 X3.GND1 33.2,33.12 33.2,31.8 32.9,31.5 v32.11,31.5 | CP4.1 43.19,16.38 v43.19,14.88 44.12,14.88 44.6,14.4 44.6,12.81 R16.1 | v19.2,37.99 19.2,41.32 CP27.1
  Top 0.762: v62.05,20.65 v62.05,20.64 | 61.99,24.65 v61.99,24.73 | C45.GND 52.4,26.64 52.4,27.3 | C3.1 C4.1 R4.1 | C40.GND 37.15,30.27 | D_P.3 16.95,16.71 v22.97,16.71 | X4.GND1 32.77,41.52 v31.3,41.52 | X3.GND1 X3.GND2
  Top 1: C5.2 86.26,9.11 85.49,8.34 84.37,8.34 C1.- 80.02,7.59 N1.2 76.65,7.32 C10.- 71.96,8.14 71.19,8.14 70.11,9.22 C11.1 | C15.1 73.64,41.06 75.3,39.4 76.17,39.4 C14.- 82.2,39.67 N3.2 82.2,39.78 C12.- 88.21,40 89.6,40 90.84,41.24 C13.2
  Top 1.016: v35.75,24.31 37,24.31 | 37,24.31 38.05,24.31 v38.45,23.91 | C40.GND 37.15,24.45 37,24.31
  Top 1.27: NF1.GND 9.64,42.3 v9.64,42.33
  Bottom 0.254: 52.8,34.4 52.8,35.8 U1.7 52.9,35.8 52.9,36.8 51.4,36.8 51.4,35.1 48,35.1 48,33.8 R6.1
  Bottom 0.406: C27.1 63.54,32.7 | 63.54,32.7 C30.+ | C28.+ 63.54,32.7
  Bottom 0.635: CP32.1 CP30.1 | X10.P$3 v71.03,25.26 | X10.P$3 | X10.P$3 81.93,25.2 | C46.GND 47.4,17.31 | v30.63,12.59 33.39,12.59 CP8.2 | CP28.1 19.7,46.38 v19.2,46.88 | v70.9,17.42 81.77,17.42 X10.P$6
  Bottom 0.762: D_N.3 19.32,28.58 21.4,28.58 | 21.4,28.58 R25.1 | CP18.2 21.4,30.88 21.4,28.58 | CP32.1 8.97,31.82 v7.1,32.02
  Bottom 0.8: C23.2 67.57,38.49 C22.+ 69.32,38.79 N4.1 73.02,35.61 C21.+ 73.1,32.98 C20.1
  Bottom 1: C16.1 74.2,2 C17.+ 74.02,5.41 N2.1 70.2,8.77 C18.+ 69.21,9.2 67.6,9.2 66.97,9.83 C19.2
  Bottom 1.27: v47.83,14.77 47.48,14.77 C46.GND
  other vias: 24.8,7.72 54.62,24.32 59.5,12.69 71.2,21.55 62.13,3.27 14.23,9.07 96,9 96,39 7,9 7,39 86.93,5.07 48.13,40.27 62.6,39.45 87.2,36.65 81.8,47.15 53.5,33.18 70.6,28.35 44.6,35.45
  pour Bottom (isolate 0.381, rank 5): 0.6,0.6 92.8,0.6 92.8,5.6 99.6,5.6 99.6,12.8 96.6,12.8 96.6,14.6 90,14.6 90,33.6 96.4,33.6 96.4,35.4 99.6,35.4 99.6,42.2 93,42.2 93,48.6 73.6,48.6 73.6,45.8 59.4,45.8 59.4,48.4 0.8,48.4 0.8,39.8 2.4,39.8 2.6,8.2 0.6,8.2
  pour Top (isolate 0.381, rank 5): 0.6,0.6 92.8,0.6 92.8,5.6 99.8,5.6 99.8,12.8 96.6,12.8 96.6,14.6 90,14.6 90,33.6 96.4,33.6 96.4,35.4 99.6,35.4 99.6,42.2 93,42.2 93,48.6 73.6,48.6 73.6,45.8 59.4,45.8 59.4,48.4 0.8,48.4 0.8,39.8 2.4,39.8 2.6,8.2 0.6,8.2
N$1
  Top 0.406: CP31.2 CP29.2 11.89,19.79 arc-90 R23.2
  Top 0.635: NF1.2 12.16,40.06 arc-90 6.7,34.6 arc90 5.7,33.6 5.7,26.36 arc90 R22.1
  Top 0.762: R23.2 12.07,19.99 arc-90 R22.1
N$2
  Top 0.254: C24.2 arc-90 53.15,42.5 53.1,42.5 53.1,41.3 arc-90 52.75,40.95 N5.14
N$4  (via drill 0.2 pad 0.6)
  Top 0.254: A2.2 42.23,23.95 v41.9,23.95
  Top 0.406: 40.02,23.95 R11.2 40.36,23.95 v42.7,23.95
  Bottom 0.254: v41.9,23.95 v42.7,23.95 43.75,23.95 R12.1
  Bottom 0.762: R12.1 44.21,23.51 C7.1
N$5  (via drill 0.2 pad 0.4)
  Top 0.254: v56.9,32.6 v59.2,32.6
  Bottom 0.254: U1.14 56.9,32.55 v56.9,32.6 | v59.2,32.6 59.65,32.6 C27.2
N$7  (via drill 0.2 pad 0.6)
  Top 0.254: v25.7,24 25.82,23.98 A1.2
  Top 0.406: R2.2 v25.7,24
  Bottom 0.254: R3.1 27.29,24 v26.5,24 v25.7,24
  Bottom 0.762: R3.1 C2.1
N$8  (via drill 0.2 pad 0.6)
  Top 0.254: v38.28,9.05 v38.27,9.05 A4.6
  Top 0.406: R19.1 38.28,6.18 v38.28,8.2
  Bottom 0.254: R17.2 38.28,10.34 v38.28,9.05 v38.28,8.2
  Bottom 0.635: C9.2 39.25,10.61 R17.2
N$9
  Bottom 0.254: 47.3,30 C29.1 R1.1 47.65,32.3 47.7,32.3 49.2,33.8 R6.2 49.6,33.8 49.6,33.3 49.9,33.3 49.9,33.2 U1.3 | 47.3,30
N$11
  Top 0.406: C6.1 R5.2 35.6,22.62 R15.1
N$12  (via drill 0.2 pad 0.6)
  Top 0.254: R14.1 | v48.25,22.65 48.03,22.66 A2.6
  Top 0.406: A2.6 R14.1
  Bottom 0.254: C7.2 46.95,22.2 v47.5,22.65 v48.25,22.65
  Bottom 0.762: R12.2 45.99,23.51 C7.2
N$13
  Top 0.406: R15.2 37.27,16.58 R18.2 38.27,16.51 A4.3
N$14
  Top 0.406: R14.2 C8.1
N$15
  Top 0.406: A1.3 24.39,22.71 arc90 R4.2
  Top 0.635: C3.2 C4.2 R4.2
N$17
  Top 0.406: C8.2 arc90 56.1,22.58 X1.SIG
N$19
  Top 0.406: D_N.2 16.2,24 | 16.2,24 D_P.1 | R2.1 16.2,24
N$20  (via drill 0.2 pad 0.6)
  Top 0.254: v39.55,14.79 39.55,14.59 A4.2
  Top 0.406: R16.2 39.71,12.66 39.55,12.82 v39.55,13.94
  Bottom 0.254: C9.1 39.55,12.67 v39.55,13.94 v39.55,14.79
  Bottom 0.635: C9.1 R17.1
N$22
  Top 0.406: R19.2 arc-90 41.23,5.07 X2.SIG
N$23  (via drill 0.2 pad 0.6)
  Top 0.5: R22.2 10.58,28.88 arc-90 16,34.3 24.7,34.3 arc-90 v27.3,31.7
  Bottom 0.406: A3.2 27.27,28.71 arc-90 R20.1
  Bottom 0.635: A3.2 27.27,31.68 arc-90 v27.3,31.7
N$24
  Bottom 0.406: A3.1 28.55,28.95 arc90 R20.2 R21.1
N$26  (via drill 0.2 pad 0.6)
  Top 0.5: X3.SIG arc-90 34.8,31.77 v34.8,30.7
  Bottom 0.5: R21.2 arc-90 32.46,28.6 33.4,28.6 arc90 34.8,30 v34.8,30.7
N$27
  Top 0.406: D_P.2 arc-90 D_P.2 R23.1 arc-90 13.8,20.06 13.8,20.7 arc90 12.98,21.52 R24.1
N$28
  Bottom 0.635: R27.1 arc90 13.66,28.54 D_N.1
  Bottom 0.762: R26.2 arc90 11.42,28 D_N.1
N$29  (via drill 0.2 pad 0.6)
  Top 0.5: X4.SIG arc-90 33.8,39 v32.9,39
  Bottom 0.5: R31.2 arc90 30.62,39 v32.9,39
N$30  (via drill 0.2 pad 0.6)
  Top 0.5: R24.2 11.98,28.18 arc-90 17,33.2 24.5,33.2 arc-90 v26,31.7
  Bottom 0.406: A3.3 26,29.17 arc-90 R25.2
  Bottom 0.5: A3.3 v26,31.7 arc90 v26,31.7
N$34
  Bottom 0.406: CP30.2 R26.1
  Bottom 0.635: R28.1 arc90 15.71,32.01
  Bottom 0.762: NF2.1 13.52,36.31 arc-90 15.71,34.12 15.71,32.01 | R28.1 11.87,31.99 CP32.2 CP30.2
N$35
  Bottom 0.406: A3.6 26,38.62 arc90 R30.1
  Bottom 0.5: R27.2 R27.2 arc90 20.4,33.5 20.4,33.8 arc-90 21.9,35.3 25.3,35.3 arc90 26,36.01 A3.6
N$37
  Bottom 0.406: A3.5 24.73,37.56 arc90 23.7,38.6 23.7,38.78 arc-90 R29.2
  Bottom 0.5: A3.5 22.39,36.91 arc90 R28.2
N$38
  Bottom 0.406: A3.7 27.27,39.04 arc-90 R30.2 R31.1
N$41  (via drill 0.3 pad 0.6)
  Top 0.635: A1.4 25.95,20.06 CP2.2 27.34,19.59 v27.82,19.11
  Bottom 0.635: v27.82,19.11 27.91,19.02 C41.2
N$43
  Top 0.406: A1.7 33.46,23.98 CP1.2
  Top 0.635: CP1.2 33.83,26.18 C40.1
N$45  (via drill 0.81 pad 1.52)
  Top 0.635: A2.4 CP4.2 42.62,19.1
  Top 0.762: 42.62,19.1 44.03,19.1 v44.27,19.35
  Bottom 0.762: C46.2 44.27,17.39 v44.27,19.35
N$46
  Top 0.406: A2.7 50.08,23.93 CP3.2 50.24,24.09
  Top 0.635: 50.16,23.93 CP3.2 50.24,24.02 | 50.24,24.09 C45.1
N$50  (via drill 0.2 pad 0.6)
  Top 0.254: v32.1,22.7 31.68,22.7 A1.6 | 33.75,22.7 R5.1
  Top 0.406: v32.1,22.7 33.75,22.7
  Bottom 0.254: C2.2 30.64,22.24 v31.3,22.7 v32.1,22.7
  Bottom 0.762: R3.2 C2.2
RF
  Top 0.254: 39.71,22.66 C6.2
  Top 0.406: A2.3 39.71,22.66 R10.2 L2.2

### Text on the board
tPlace: DC_N | DC_P | AC | DC